# Altium schematic sheet BalEv_USB_v1_0.SchDoc
size A4; CompanyName: HESSO; Address1: Route du Rawyl 47; Address2: 1950 Sion; Address3: Switzerland; DocumentNumber: 6; SheetNumber: 3; SheetTotal: 9; PageSetup: Record=PageOptions|CenterHorizontal=True|CenterVertical=True|PrintScale=1.00|XCorrection=1.00|YCorrection=1.00|PrintKind=1|BorderSize=5000000|LeftOffset=0|BottomOffset=0|Orientation=2|PaperLength=1000|PaperWidth=1000|Scale=100|PaperSource=15|PrintQuality=1200|MediaType=1|DitherType=10|PrintScaleMode=1|PaperKind=A4|PaperIndex=9; ProjectName: Project Name
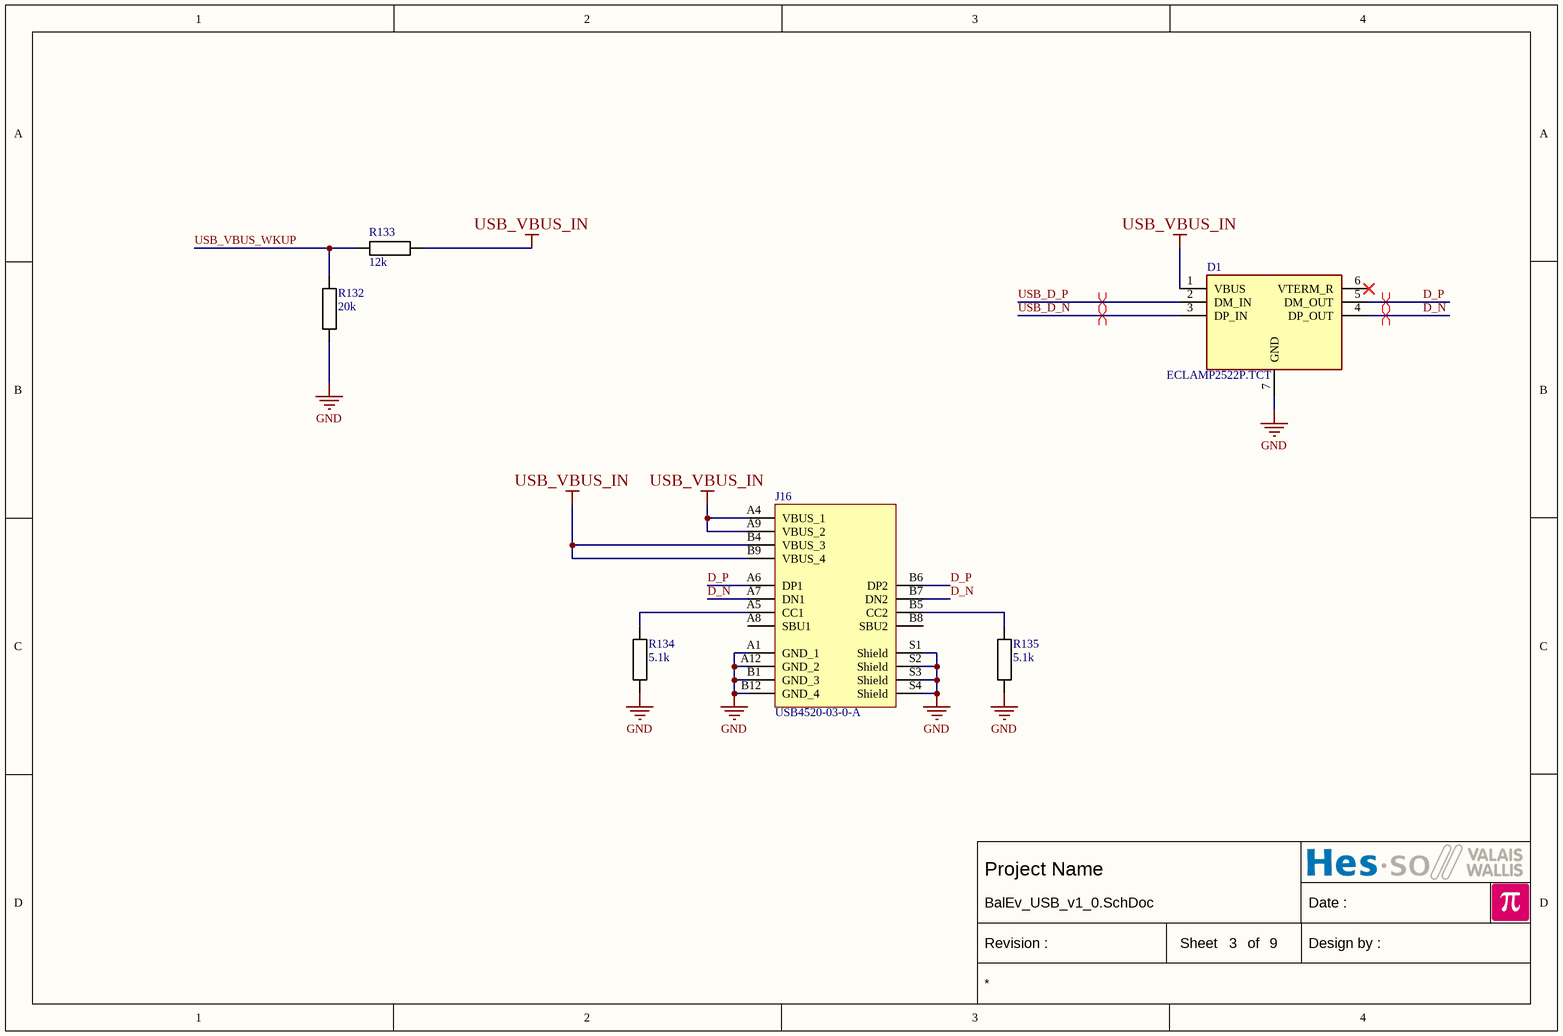
[diagram p0: BalEv_USB_v1_0.SchDoc]

## Parts
D1  ECLAMP2522P.TCT  [SON50P160X160X65-7N]
J16  USB4520-03-0-A  [USB-C-SMD GCT USB4520030A]
R132  20k  [RESISTOR 1005 REFLOW]
R133  12k  [RESISTOR 1005 REFLOW]
R134  5.1k  [RESISTOR 1005 REFLOW]
R135  5.1k  [RESISTOR 1005 REFLOW]

## Nets
GND: D1.7(GND) J16.A1(GND_1) J16.A12(GND_2) J16.B1(GND_3) J16.B12(GND_4) J16.S1(Shield) J16.S2(Shield) J16.S3(Shield) J16.S4(Shield) R132.2 R134.2 R135.2
USB_VBUS_IN: D1.1(VBUS) J16.A4(VBUS_1) J16.A9(VBUS_2) J16.B4(VBUS_3) J16.B9(VBUS_4) R133.1
D_N: D1.4(DP_OUT) J16.A7(DN1) J16.B7(DN2)
D_P: D1.5(DM_OUT) J16.A6(DP1) J16.B6(DP2)
USB_D_N: D1.3(DP_IN)
USB_D_P: D1.2(DM_IN)
USB_VBUS_WKUP: R132.1 R133.2
NetJ16_A5: J16.A5(CC1) R134.1
NetJ16_B5: J16.B5(CC2) R135.1

Not connected (* = marked no-connect by the designer): D1 6(VTERM_R)*; J16 A8(SBU1) B8(SBU2)

## Layout directives
differential pair: D_N, D_P, USB_D_N, USB_D_P

## Notes on the sheet
- Date :
- Revision :
- Sheet
- of
- Design by :

## Library data of the parts
D1 = ECLAMP2522P.___: Integrated Circuit; Value: ECLAMP2522P.TCT
J16 = USB-C SMD GTC USB4520-03-0-A: Connector; Value: USB4520-03-0-A
R132-R135 = Resistor
  R132: Value: 20k; STOCK: NO
  R133: Value: 12k; STOCK: NO
  R134 R135: Value: 5.1k